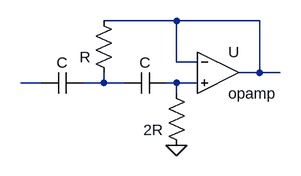
[diagram p0: schematic ActiveHPF.asc]
ActiveHPF.asc, the LTspice schematic file:
Version 4
SHEET 1 880 680
WIRE 160 80 48 80
WIRE 288 80 160 80
WIRE 160 144 160 80
WIRE 192 144 160 144
WIRE 288 160 288 80
WIRE 288 160 256 160
WIRE 320 160 288 160
WIRE -48 176 -80 176
WIRE 48 176 48 160
WIRE 48 176 16 176
WIRE 80 176 48 176
WIRE 160 176 144 176
WIRE 192 176 160 176
WIRE 160 192 160 176
FLAG 160 272 0
SYMBOL Opamps\\opamp 224 96 R0
SYMATTR InstName U
SYMBOL cap 144 160 R90
WINDOW 0 0 32 VBottom 2
WINDOW 3 32 32 VTop 2
SYMATTR InstName C
SYMATTR Value ""
SYMBOL res 176 288 R180
WINDOW 3 36 19 Left 2
SYMATTR InstName 2R
SYMATTR Value ""
SYMBOL res 64 176 R180
WINDOW 3 36 19 Left 2
SYMATTR InstName R
SYMATTR Value ""
SYMBOL cap 16 160 R90
WINDOW 0 0 32 VBottom 2
WINDOW 3 32 32 VTop 2
SYMATTR InstName C
SYMATTR Value ""

The netlist it stands for:
* ActiveHPF.asc
XU N001 N004 N001 opamp Aol=100K GBW=10Meg  ; pins invin noninvin out
C N004 N003
R§2R 0 N004
R N003 N001
C N003 N002
.backanno
.end